# EAGLE design csa_pwr_v1.2b (EAGLE 4.15)
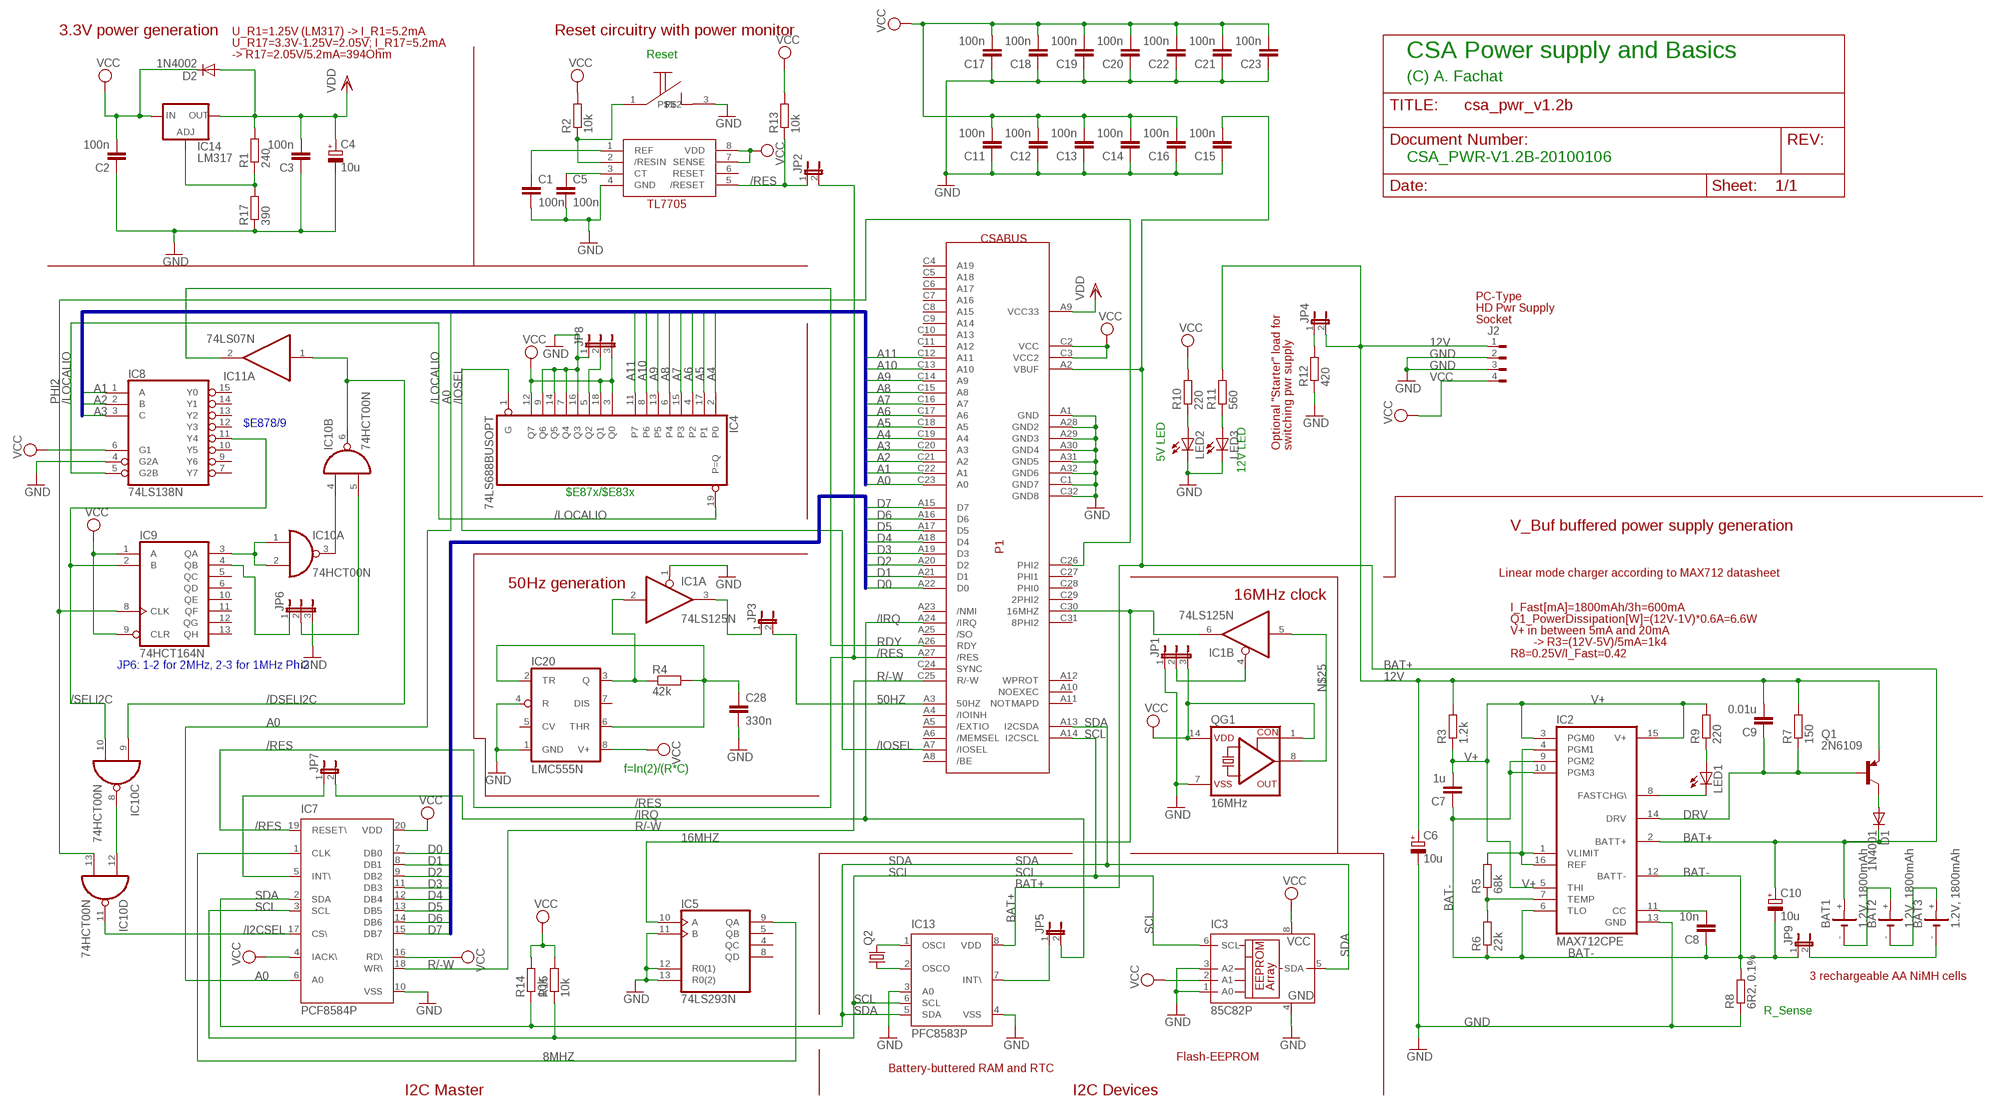
[diagram p0: schematic, sheet 1]

## Parts
BAT1  1.2V, 1800mAh  BATTERYAA  [BATTERY-AA]
BAT2  1.2V, 1800mAh  BATTERYAA  [BATTERY-AA]
BAT3  1.2V, 1800mAh  BATTERYAA  [BATTERY-AA]
C1  100n  C-EU025-025X050  [C025-025X050]
C2  100n  C5/2.5  [C5B2.5]
C3  100n  C5/2.5  [C5B2.5]
C4  10u  CPOL-EUE2-5  [E2-5]
C5  100n  C-EU025-025X050  [C025-025X050]
C6  10u  CPOL-EUE2-5  [E2-5]
C7  1u  C5/2.5  [C5B2.5]
C8  10n  C5/2.5  [C5B2.5]
C9  0.01u  C5/2.5  [C5B2.5]
C10  10u  CPOL-EUE2-5  [E2-5]
C11  100n  C5/2.5  [C5B2.5]
C12  100n  C5/2.5  [C5B2.5]
C13  100n  C5/2.5  [C5B2.5]
C14  100n  C5/2.5  [C5B2.5]
C15  100n  C5/2.5  [C5B2.5]
C16  100n  C5/2.5  [C5B2.5]
C17  100n  C5/2.5  [C5B2.5]
C18  100n  C5/2.5  [C5B2.5]
C19  100n  C5/2.5  [C5B2.5]
C20  100n  C5/2.5  [C5B2.5]
C21  100n  C5/2.5  [C5B2.5]
C22  100n  C5/2.5  [C5B2.5]
C23  100n  C5/2.5  [C5B2.5]
C28  330n  C-EU050-025X075  [C050-025X075]
D1  1N4001  DIODE-C1702-15  [C1702-15]
D2  1N4002  DIODE-C1702-15  [C1702-15]
IC1  74LS125N  [DIL14]
IC2  MAX712CPE  [DIL16]
IC3  85C82P  [DIL8]
IC4  74LS688BUSOPT  [DIL20]
IC5  74LS293N  [DIL14]
IC7  PCF8584P  [DIL20]
IC8  74LS138N  [DIL16]
IC9  74HCT164N  [DIL14]
IC10  74HCT00N  [DIL14]
IC11  74LS07N  [DIL14]
IC13  PFC8583P  [DIL08]
IC14  LM317  LM317TL  [317TL]
IC20  LMC555N  LM555N  [DIL08]
J2  FLOP-4W827001  [827001]
JP1  JP2E  [JP2]
JP2  JP1E  [JP1]
JP3  JP1E  [JP1]
JP4  JP1E  [JP1]
JP5  JP1E  [JP1]
JP6  JP2E  [JP2]
JP7  JP1E  [JP1]
JP8  JP2E  [JP2]
JP9  JP1E  [JP1]
LED1  LED3MM  [LED3MM]
LED2  LED3MM  [LED3MM]
LED3  LED3MM  [LED3MM]
P1  CSABUS  [CSABUS]
Q1  2N6109  2N6107  [TO220]
Q2  CRYTALHC49S  [HC49/S]
QG1  16MHz  CRYSTAL_RES-SG51  [SG51]
R1  240  R-EU_0204/5  [0204/5]
R2  10k  R-EU_0207/10  [0207/10]
R3  1.2k  R-EU_0204/5  [0204/5]
R4  42k  R-EU_0204/7  [0204/7]
R5  68k  R-EU_0204/5  [0204/5]
R6  22k  R-EU_0204/5  [0204/5]
R7  150  R-EU_0204/5  [0204/5]
R8  6R2, 0.1%  R-EU_0204/5  [0204/5]
R9  220  R-EU_0204/5  [0204/5]
R10  220  R-EU_0204/5  [0204/5]
R11  560  R-EU_0204/5  [0204/5]
R12  420  R-EU_RDH/15  [RDH/15]
R13  10k  R-EU_0207/10  [0207/10]
R14  10k  R-EU_0204/7  [0204/7]
R15  10k  R-EU_0204/7  [0204/7]
R17  390  R-EU_0204/5  [0204/5]
U$1  TL7705  [DIL08]
U$2  TASTER  [TASTER]

## Nets
8MHZ: IC5.9(QA) IC7.1(CLK)
12V: C6.+ C9.2 J2.1 JP4.2 Q1.3(E) R3.2 R7.2 R11.2
16MHZ: IC1.6(B:O) IC5.10(A) P1.C30(16MHZ)
50HZ: JP3.2 P1.A3(50HZ)
/DSELI2C: IC10.6(B:O) IC10.9(C:I0) IC11.1(A:I)
/I2CSEL: IC7.17(CS\) IC10.11(D:O)
/IOSEL: IC4.1(G) P1.A7(/IOSEL)
/IRQ: JP5.2 JP7.2 P1.A24(/IRQ)
/LOCALIO: IC4.19(P=Q) IC8.5(G2B)
/RES: IC7.19(RESET\) JP2.1 JP2.2 P1.A27(/RES) R13.1 U$1.5(/RESET)
/SELI2C: IC8.11(Y4) IC9.2(B) IC10.10(C:I1)
A0: IC7.6(A0) P1.C23(A0)
A1: IC8.1(A) P1.C22(A1)
A2: IC8.2(B) P1.C21(A2)
A3: IC8.3(C) P1.C20(A3)
A4: IC4.2(P0) P1.C19(A4)
A5: IC4.17(P1) P1.C18(A5)
A6: IC4.4(P2) P1.C17(A6)
A7: IC4.15(P3) P1.C16(A7)
A8: IC4.6(P4) P1.C15(A8)
A9: IC4.13(P5) P1.C14(A9)
A10: IC4.8(P6) P1.C13(A10)
A11: IC4.11(P7) P1.C12(A11)
BAT+: BAT1.+ C10.+ C15.2 D1.C IC2.2(BATT+) IC13.8(VDD) P1.A2(VBUF)
BAT-: C7.1 C8.1 C10.- IC2.6(TLO) IC2.9(PGM2) IC2.10(PGM3) IC2.12(BATT-) JP9.1 R6.1 R8.2
D0: IC7.7(DB0) P1.A22(D0)
D1: IC7.8(DB1) P1.A21(D1)
D2: IC7.9(DB2) P1.A20(D2)
D3: IC7.11(DB3) P1.A19(D3)
D4: IC7.12(DB4) P1.A18(D4)
D5: IC7.13(DB5) P1.A17(D5)
D6: IC7.14(DB6) P1.A16(D6)
D7: IC7.15(DB7) P1.A15(D7)
DRV: C9.1 IC2.14(DRV) Q1.1(B) R7.1
GND: C1.2 C2.1 C3.1 C4.- C5.2 C6.- C11.1 C12.1 C13.1 C14.1 C15.1 C16.1 C17.1 C18.1 C19.1 C20.1 C21.1 C22.1 C23.1 C28.2 IC1.1(A:OE) IC2.13(GND) IC3.1(A0) IC3.3(A2) IC3.4(GND) IC4.7(Q4) IC4.9(Q6) IC4.14(Q5) IC4.16(Q3) IC5.11(B) IC5.12(R0(1)) IC5.13(R0(2)) IC7.10(VSS) IC8.4(G2A) IC13.3(A0) IC13.4(VSS) IC20.1(GND) IC20.4(R) J2.2 J2.3 JP1.1 JP6.3 JP8.1 LED2.K(C) LED3.K(C) P1.A1(GND) P1.A28(GND2) P1.A29(GND3) P1.A30(GND4) P1.A31(GND5) P1.A32(GND6) P1.C1(GND7) P1.C32(GND8) QG1.7(VSS) R8.1 R12.1 R17.1 U$1.4(GND) U$2.3
N$1: C5.1 U$1.3(CT)
N$2: IC14.1(ADJ) R1.1 R17.2
N$3: C1.1 U$1.1(REF)
N$4: IC10.8(C:O) IC10.12(D:I0)
N$5: IC4.5(Q2) JP8.2
N$6: IC1.2(A:I) IC20.3(Q) R4.1
N$7: R2.1 U$1.2(/RESIN) U$2.1
N$9: IC1.4(B:OE) JP1.2
N$10: BAT3.- JP9.2
N$11: IC2.1(VLIMIT) IC2.4(PGM1) IC2.16(REF) R5.2
N$12: IC2.7(TEMP) R5.1 R6.2
N$13: LED1.A R9.1
N$14: IC2.8(FASTCHG\) LED1.K(C)
N$15: BAT2.- BAT3.+
N$16: C8.2 IC2.11(CC)
N$17: BAT1.- BAT2.+
N$18: LED2.A R10.1
N$19: LED3.A R11.1
N$20: D1.A Q1.2(C)
N$21: JP4.1 R12.2
N$22: IC13.7(INT\) JP5.1
N$23: IC13.2(OSCO) Q2.1
N$24: IC13.1(OSCI) Q2.2
N$25: IC1.5(B:I) QG1.8(OUT)
N$27: IC9.3(QA) IC10.1(A:I0) IC10.2(A:I1)
N$28: IC9.4(QB) JP6.1
N$29: IC10.5(B:I1) JP6.2
N$30: IC10.3(A:O) IC10.4(B:I0)
N$55: IC1.3(A:O) JP3.1
N$56: C28.1 IC20.2(TR) IC20.6(THR) R4.2
N$72: IC7.5(INT\) JP7.1
PHI2: IC9.8(CLK) IC10.13(D:I1) P1.C26(PHI2)
R/-W: IC7.18(WR\) P1.C25(R/-W)
RDY: IC11.2(A:O) P1.A26(RDY)
SCL: IC3.6(SCL) IC7.3(SCL) IC13.6(SCL) P1.A14(I2CSCL) R15.1
SDA: IC3.5(SDA) IC7.2(SDA) IC13.5(SDA) P1.A13(I2CSDA) R14.1
V+: C7.2 IC2.3(PGM0) IC2.5(THI) IC2.15(V+) R3.1 R9.2
VCC: C2.2 C11.2 C12.2 C13.2 C14.2 C16.2 C17.2 C18.2 C19.2 C20.2 C21.2 C22.2 C23.2 D2.C IC3.2(A1) IC3.8(VCC) IC4.3(Q0) IC4.12(Q7) IC4.18(Q1) IC7.4(IACK\) IC7.16(RD\) IC7.20(VDD) IC8.6(G1) IC9.1(A) IC9.9(CLR) IC14.3(IN) IC20.8(V+) J2.4 JP1.3 JP8.3 P1.C2(VCC) P1.C3(VCC2) QG1.1(CON) QG1.14(VDD) R2.2 R10.2 R13.2 R14.2 R15.2 U$1.7(SENSE) U$1.8(VDD)
VDD: C3.2 C4.+ D2.A IC14.2(OUT) P1.A9(VCC33) R1.2
Unconnected: IC1.8(C:O) IC1.9(C:I) IC1.10(C:OE) IC1.11(D:O) IC1.12(D:I) IC1.13(D:OE) IC3.7(NC) IC5.4(QC) IC5.5(QB) IC5.8(QD) IC8.7(Y7) IC8.9(Y6) IC8.10(Y5) IC8.12(Y3) IC8.13(Y2) IC8.14(Y1) IC8.15(Y0) IC9.5(QC) IC9.6(QD) IC9.10(QE) IC9.11(QF) IC9.12(QG) IC9.13(QH) IC11.3(B:I) IC11.4(B:O) IC11.5(C:I) IC11.6(C:O) IC11.8(D:O) IC11.9(D:I) IC11.10(E:O) IC11.11(E:I) IC11.12(F:O) IC11.13(F:I) IC20.5(CV) IC20.7(DIS) P1.A4(/IOINH) P1.A5(/EXTIO) P1.A6(/MEMSEL) P1.A8(/BE) P1.A10(NOEXEC) P1.A11(NOTMAPD) P1.A12(WPROT) P1.A23(/NMI) P1.A25(/SO) P1.C4(A19) P1.C5(A18) P1.C6(A17) P1.C7(A16) P1.C8(A15) P1.C9(A14) P1.C10(A13) P1.C11(A12) P1.C24(SYNC) P1.C27(PHI1) P1.C28(PHI0) P1.C29(2PHI2) P1.C31(8PHI2) U$1.6(RESET)

## Buses
D[0..7]
A[0..11]

## Notes on the sheet
- 3.3V power generation | U_R1=1.25V (LM317) -> I_R1=5.2mA | Reset circuitry with power monitor
- U_R17=3.3V-1.25V=2.05V; I_R17=5.2mA
- -> R17=2.05V/5.2mA=394Ohm | Reset | CSA Power supply and Basics
- (C) A. Fachat
- CSA_PWR-V1.2B-20100106
- PC-Type
- HD Pwr Supply
- Socket
- $E878/9
- Optional "Starter" load for | switching pwr supply
- 5V LED
- 12V LED
- $E87x/$E83x
- V_Buf buffered power supply generation
- Linear mode charger according to MAX712 datasheet
- 50Hz generation
- 16MHz clock
- I_Fast[mA]=1800mAh/3h=600mA
- Q1_PowerDissipation[W]=(12V-1V)*0.6A=6.6W
- V+ in between 5mA and 20mA
- -> R3=(12V-5V)/5mA=1k4
- R8=0.25V/I_Fast=0.42
- JP6: 1-2 for 2MHz, 2-3 for 1MHz Phi2
- f=ln(2)/(R*C)
- 3 rechargeable AA NiMH cells
- R_Sense
- Flash-EEPROM
- Battery-buttered RAM and RTC
- I2C Master | I2C Devices

## Power pins joined to a net without a drawn wire
GND: IC1.7(P:GND) IC4.10(GND) IC5.7(GND) IC8.8(GND) IC9.7(GND) IC10.7(P:GND) IC11.7(P:GND)
VCC: IC1.14(P:VCC) IC4.20(VCC) IC5.14(VCC) IC8.16(VCC) IC9.14(VCC) IC10.14(P:VCC) IC11.14(P:VCC)

## Library data of the parts
BAT1-BAT3 = csa:BATTERY
C1 C5 C28 = rcl:C-EU: CAPACITOR, European symbol
C2 C3 C7-C9 C11-C23 = capacitor-wima:C: CAPACITOR naming: grid - package width
C4 C6 C10 = rcl:CPOL-EU: POLARIZED CAPACITOR, European symbol
D1 D2 = diode:DIODE-: DIODE
IC1 = 74xx-eu:74*125: Quad bus BUFFER, 3-state
IC2 = maxim:MAX71*?: NiCd/NiMH Battery Fast-Charge Controller
IC3 = microchip:85C*: Serial EEPROM 1 K/2 K/4 K, 5.0 V, CMOS 85C72/82/92
IC4 = csa:74LS688BUSOPT
IC5 = 74xx-us:74*293: Decade and 4-bit BINARY COUNTER
IC7 = micro-philips:PCF8584: I2C-Bus CONTROLLER
IC8 = 74xx-eu:74*138: 3-line to 8-line DECODER/DEMULTIPLEXER
IC9 = 74xx-eu:74*164: 8-bit parallel out SHIFT REGISTER
IC10 = 74xx-eu:74*00: Quad 2-input NAND gate
IC11 = 74xx-eu:74*07: Hex BUFFER, open collector high-voltage output
IC13 = micro-philips:PFC8583: I2C-Bus CLOCK/CALENDAR
IC14 = v-reg:LM317TL: VOLTAGE REGULATOR
IC20 = linear:*555: TIMER
J2 = con-amp:FLOP-4W: MATE N-LOCK Floppy / HDD conector Distributor: Bürklin 71F972
JP1 JP6 JP8 = jumper:JP2E: JUMPER
JP2-JP5 JP7 JP9 = jumper:JP1E: JUMPER
LED1-LED3 = led:LED: LED OSRAM: - CHIPLED LG R971, LG N971, LY N971, LG Q971, LY Q971, LO R971, LY R971 LH N974, LH R974 LS Q976, LO Q976, LY Q976 LO Q996 - Hyper CHIPLED LW Q18S LB Q993, LB Q99A, LB R99A - SideLED LS A670, LO A670, LY A670, LG A670, LP A670 LB A673, LV A673, LT A673, LW A673 LH A674 LY A675 LS A676, LA A676, LO A676, LY A676, LW A676 LS A679, LY A679, LG A679 - Hyper Micro SIDELED® LS Y876, LA Y876, LO Y876, LY Y876 LT Y87S - SmartLED LW L88C, LW L88S LB L89C, LB L89S, LG L890 LS L89K, LO L89K, LY L89K LS L896, LA L896, LO L896, LY L896 - TOPLED LS T670, LO T670, LY T670, LG T670, LP T670 LSG T670, LSP T670, LSY T670, LOP T670, LYG T670 LG T671, LOG T671, LSG T671 LB T673, LV T673, LT T673, LW T673 LH T674 LS T676, LA T676, LO T676, LY T676, LB T676, LH T676, LSB T676, LW T676 LB T67C, LV T67C, LT T67C, LS T67K, LO T67K, LY T67K, LW E67C LS E67B, LA E67B, LO E67B, LY E67B, LB E67C, LV E67C, LT E67C LW T67C LS T679, LY T679, LG T679 LS T770, LO T770, LY T770, LG T770, LP T770 LB T773, LV T773, LT T773, LW T773 LH T774 LS E675, LA E675, LY E675, LS T675 LS T776, LA T776, LO T776, LY T776, LB T776 LHGB T686 LT T68C, LB T68C - Hyper Mini TOPLED® LB M676 - Mini TOPLED Santana® LG M470 LS M47K, LO M47K, LY M47K Source: http://www.osram.convergy.de/
P1 = csa:CSABUS
Q1 = transistor-pnp:2N6107: PNP Transistor
Q2 = crystal:CRYTAL: CRYSTAL
QG1 = crystal:CRYSTAL_RES-: CRYSTAL RESONATOR
R1-R15 R17 = rcl:R-EU_: RESISTOR, European symbol
U$1 = csa:TL7705
U$2 = csa:TASTER

## Board
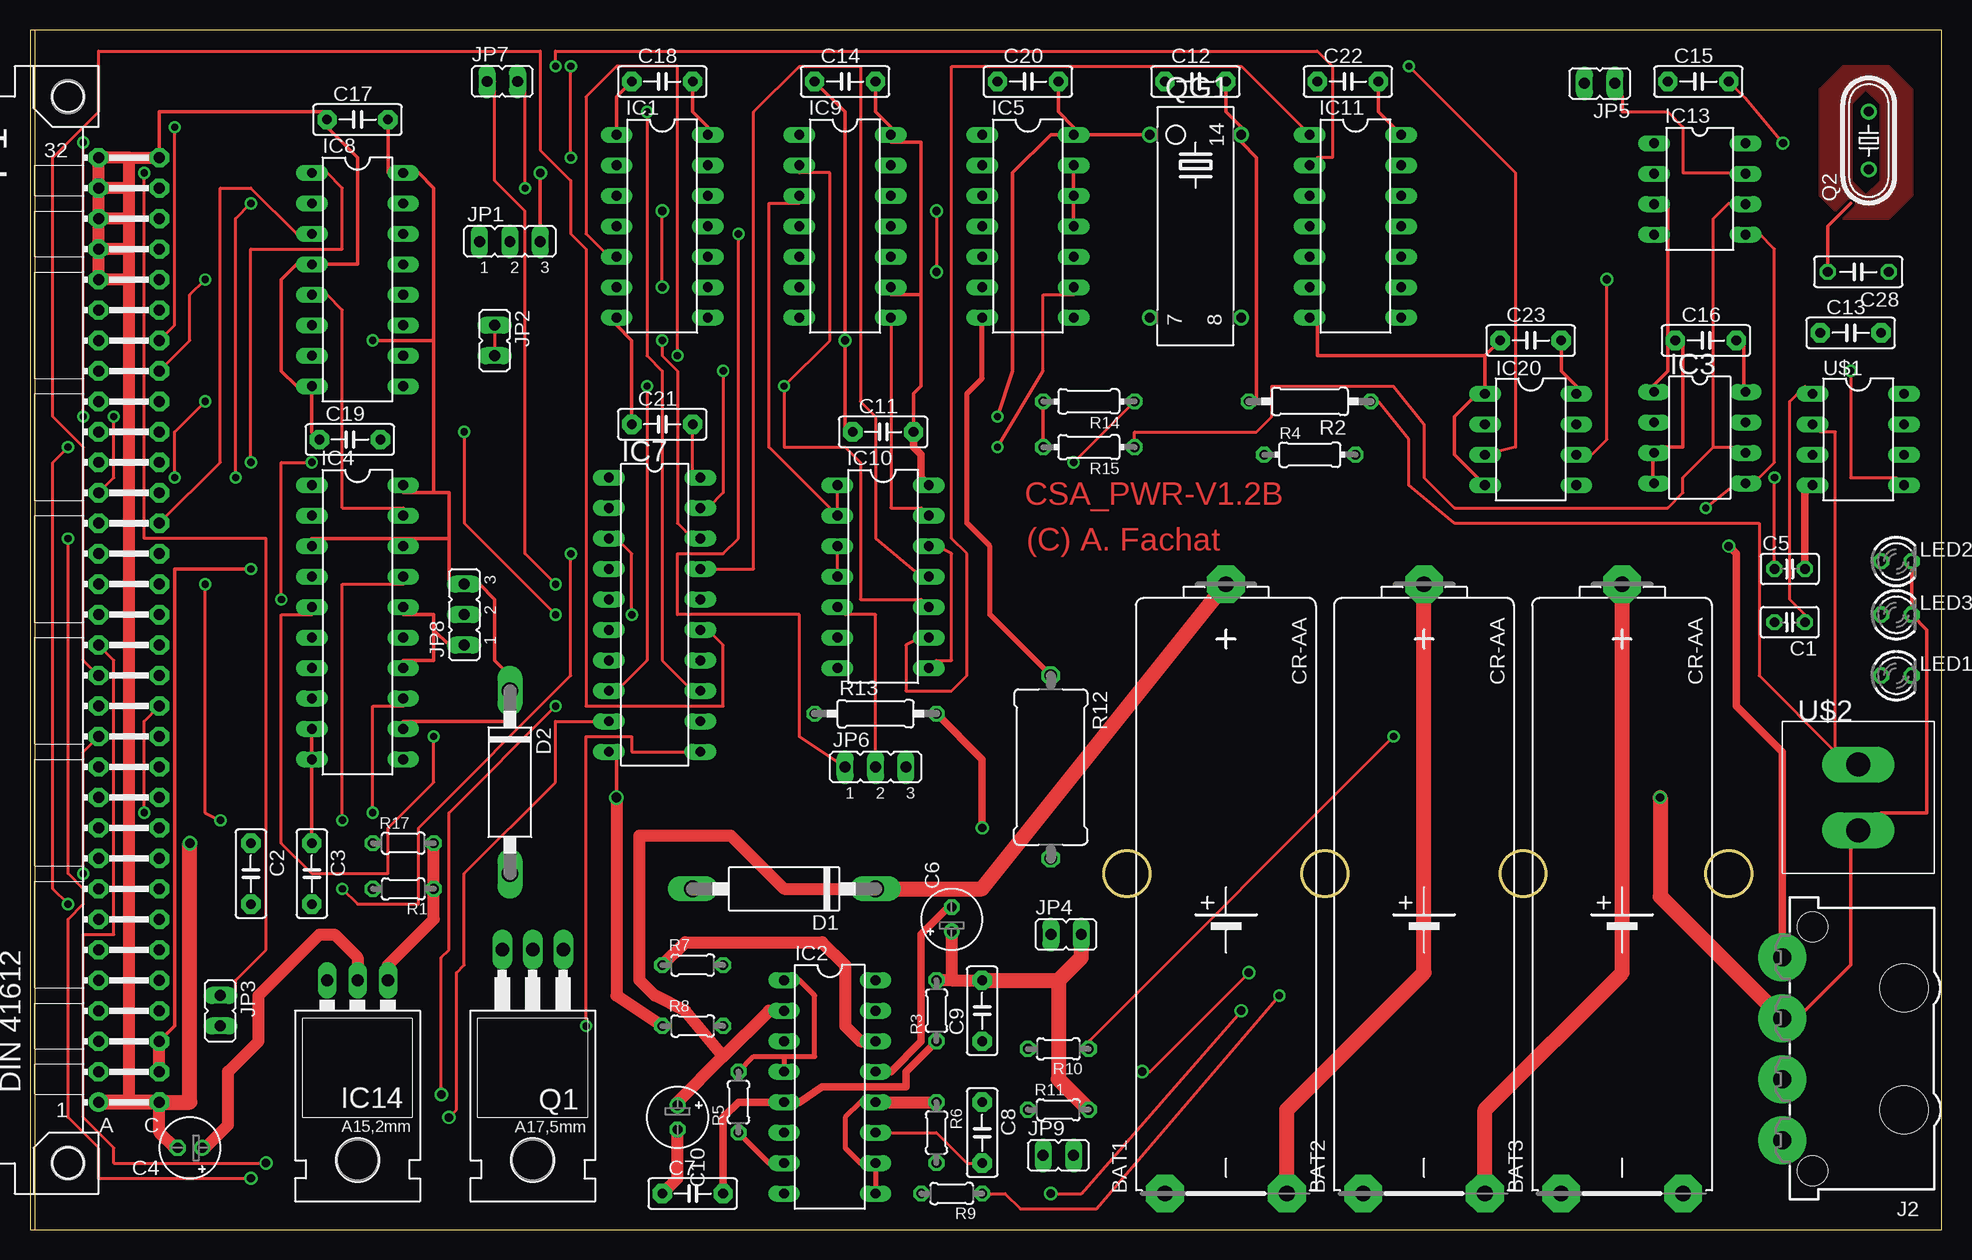
[diagram p1: board, top side]
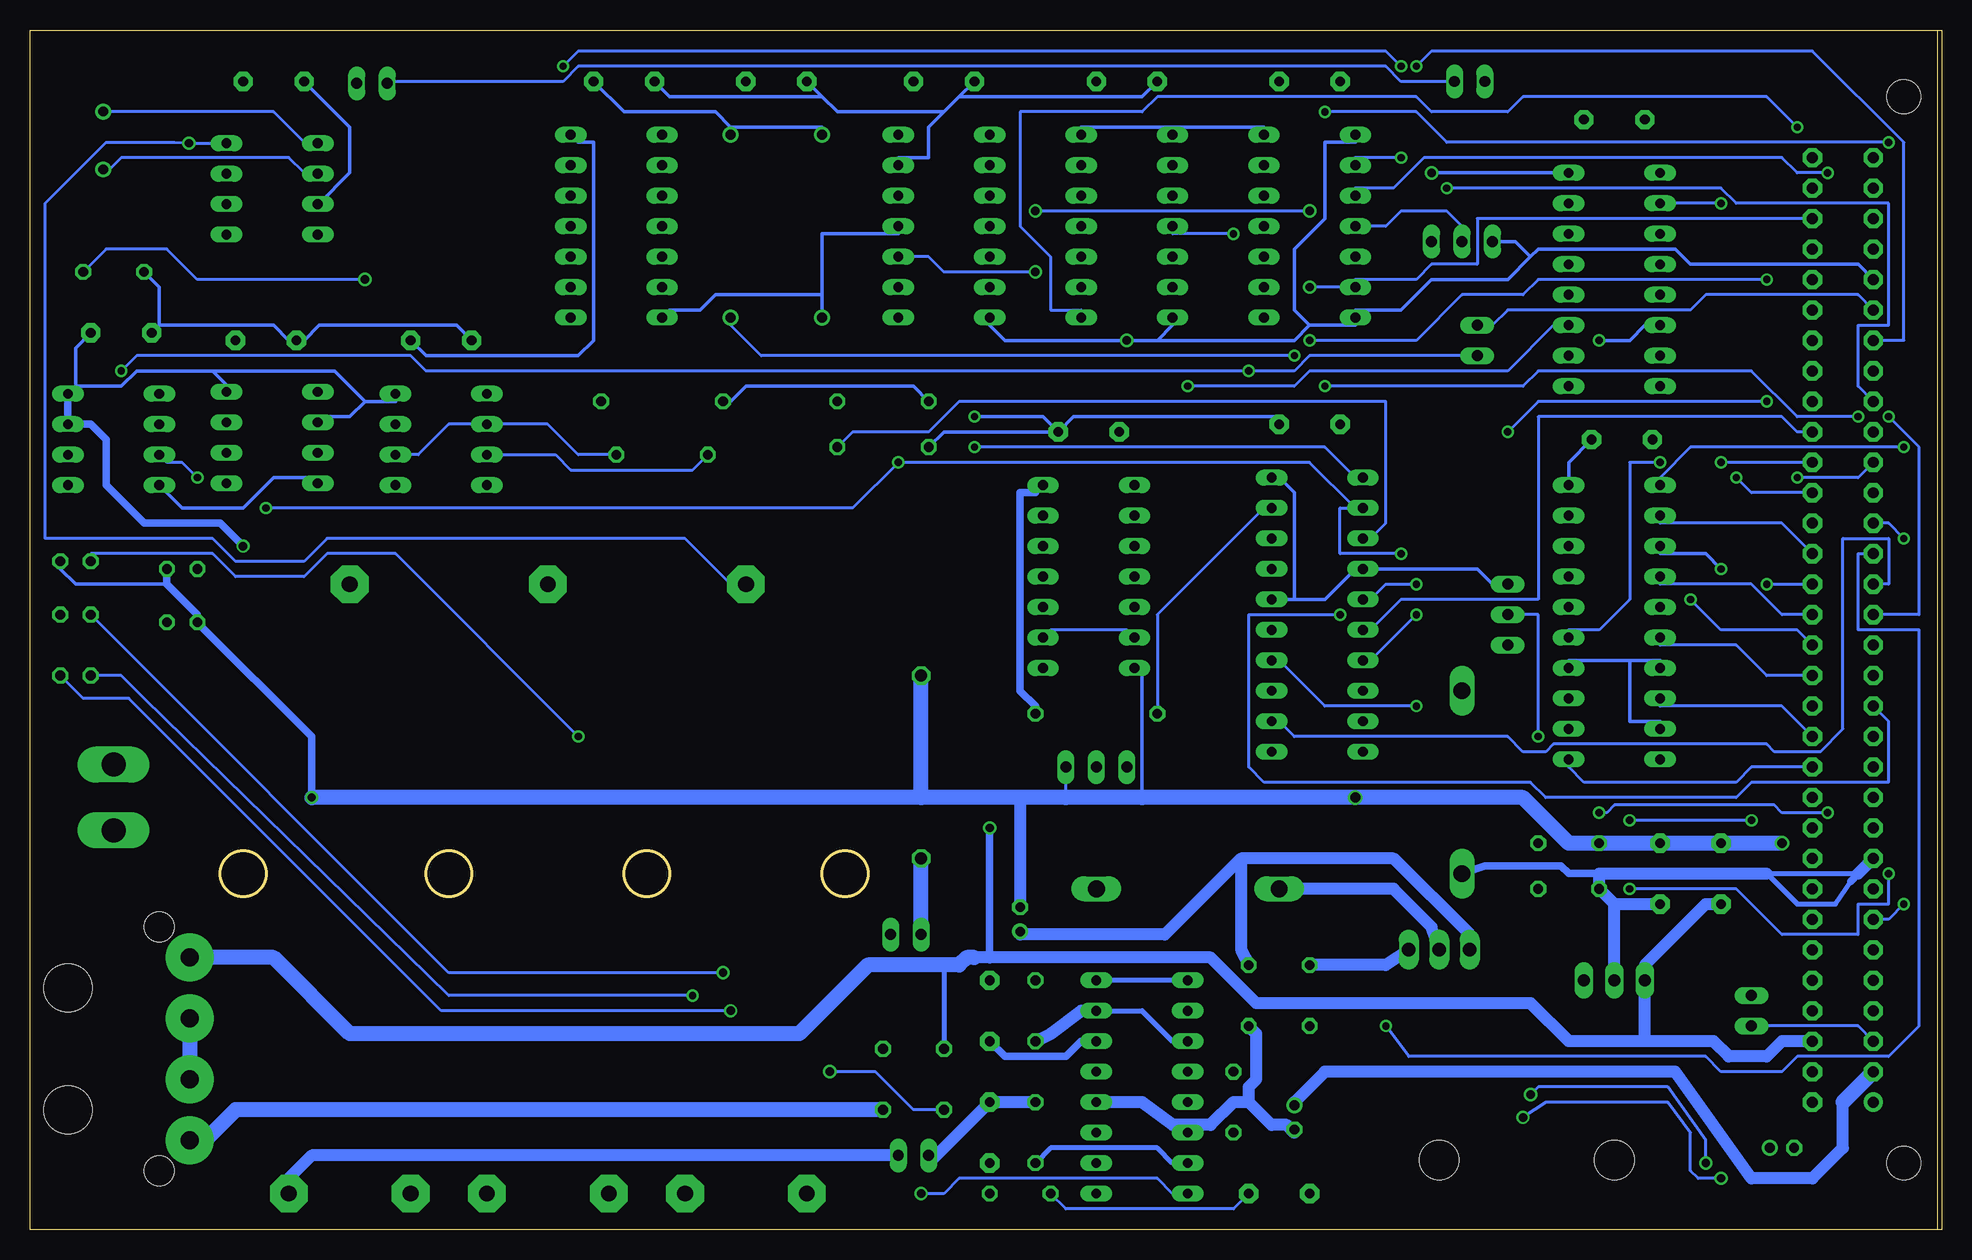
[diagram p2: board, bottom side, seen from below]

Size 159.37 x 100.03 mm. Coordinates in mm from the lower left corner, seen from the top.
Outline: 0,0.01 159.37,0.01 159.37,100.01 0,100.01 0,0.01
Outline: circle at 91.44,29.69 radius 1.91
Outline: circle at 141.6,29.69 radius 1.91
Outline: circle at 107.94,29.69 radius 1.91
Outline: circle at 124.45,29.69 radius 1.91
Copper layers (1*16): Top 0.035mm / dielectric 1.5mm / Bottom 0.035mm
Design rules "default": minimum track width 10mil, minimum drill 24mil, track to track 8mil, track to pad 8mil, pad to pad 8mil, via to via 8mil, smd to smd 8mil, copper to edge 40mil, drill to drill 8mil, minimum pad ring 10mil, minimum via ring 8mil, stop-mask expansion 4mil, vias tented up to drill 0mil, thermal gap 10mil

### Footprints (pad centres in the part's own frame; a part is rotated, then mirrored left to right if it is on the bottom)
BATTERY-AA = drill 1.321 pad 3.15 octagon: + 27.94,0; - -22.86,-5.08; -@1 -22.86,5.08
C025-025X050 = drill 0.813 octagon: 1 -1.27,0; 2 1.27,0
C5B2.5 = drill 0.813 pad 1.6 octagon: 1 -2.54,0; 2 2.54,0
E2-5 = drill 0.813 pad 1.27 round: + -1.016,0 | drill 0.813 pad 1.27 octagon: - 1.016,0
C050-025X075 = drill 0.813 octagon: 1 -2.54,0; 2 2.54,0
C1702-15 = drill 1.397 long: A 7.62,0; C -7.62,0
DIL14 = drill 0.813 long: 1 -7.62,-3.81; 2 -5.08,-3.81; 3 -2.54,-3.81; 4 0,-3.81; 5 2.54,-3.81; 6 5.08,-3.81; 7 7.62,-3.81; 8 7.62,3.81; 9 5.08,3.81; 10 2.54,3.81; 11 0,3.81; 12 -2.54,3.81; 13 -5.08,3.81; 14 -7.62,3.81
DIL16 = drill 0.813 long: 1 -8.89,-3.81; 2 -6.35,-3.81; 3 -3.81,-3.81; 4 -1.27,-3.81; 5 1.27,-3.81; 6 3.81,-3.81; 7 6.35,-3.81; 8 8.89,-3.81; 9 8.89,3.81; 10 6.35,3.81; 11 3.81,3.81; 12 1.27,3.81; 13 -1.27,3.81; 14 -3.81,3.81; 15 -6.35,3.81; 16 -8.89,3.81
DIL8 = drill 0.813 long: 1 -3.81,-3.81; 2 -1.27,-3.81; 3 1.27,-3.81; 4 3.81,-3.81; 5 3.81,3.81; 6 1.27,3.81; 7 -1.27,3.81; 8 -3.81,3.81
DIL20 = drill 0.813 long: 1 -10.16,-3.81; 2 -7.62,-3.81; 3 -5.08,-3.81; 4 -2.54,-3.81; 5 0,-3.81; 6 2.54,-3.81; 7 5.08,-3.81; 8 7.62,-3.81; 9 10.16,-3.81; 10 12.7,-3.81; 11 12.7,3.81; 12 10.16,3.81; 13 7.62,3.81; 14 5.08,3.81; 15 2.54,3.81; 16 0,3.81; 17 -2.54,3.81; 18 -5.08,3.81; 19 -7.62,3.81; 20 -10.16,3.81
DIL20' = drill 0.813 long: 1 -11.43,-3.81; 2 -8.89,-3.81; 3 -6.35,-3.81; 4 -3.81,-3.81; 5 -1.27,-3.81; 6 1.27,-3.81; 7 3.81,-3.81; 8 6.35,-3.81; 9 8.89,-3.81; 10 11.43,-3.81; 11 11.43,3.81; 12 8.89,3.81; 13 6.35,3.81; 14 3.81,3.81; 15 1.27,3.81; 16 -1.27,3.81; 17 -3.81,3.81; 18 -6.35,3.81; 19 -8.89,3.81; 20 -11.43,3.81
DIL08 = drill 0.813 long: 1 -3.81,-3.81; 2 -1.27,-3.81; 3 1.27,-3.81; 4 3.81,-3.81; 5 3.81,3.81; 6 1.27,3.81; 7 -1.27,3.81; 8 -3.81,3.81
317TL = drill 1.016 long: 1 -2.54,-3.81; 2 0,-3.81; 3 2.54,-3.81 | hole 3.302: 0,11.176
827001 = drill 1.5 pad 4 round: 1 -7.62,0; 2 -2.54,0; 3 2.54,0; 4 7.62,0 | hole 4: 5.08,-10.16; -5.08,-10.16 | hole 2.5: 10.16,-2.54; -10.16,-2.54
JP2 = drill 0.914 long: 1 -2.54,0; 2 0,0; 3 2.54,0
JP1 = drill 0.914 long: 1 0,-1.27; 2 0,1.27
LED3MM = drill 0.813 octagon: A -1.27,0; K 1.27,0
CSABUS = drill 0.914 pad 1.6 round: A1 7.62,36.83 | drill 0.914 pad 1.6 octagon: A2 7.62,34.29; A3 7.62,31.75; A4 7.62,29.21; A5 7.62,26.67; A6 7.62,24.13; A7 7.62,21.59; A8 7.62,19.05; A9 7.62,16.51; A10 7.62,13.97; A11 7.62,11.43; A12 7.62,8.89; A13 7.62,6.35; A14 7.62,3.81; A15 7.62,1.27; A16 7.62,-1.27; A17 7.62,-3.81; A18 7.62,-6.35; A19 7.62,-8.89; A20 7.62,-11.43; A21 7.62,-13.97; A22 7.62,-16.51; A23 7.62,-19.05; A24 7.62,-21.59; A25 7.62,-24.13; A26 7.62,-26.67; A27 7.62,-29.21; A28 7.62,-31.75; A29 7.62,-34.29; A30 7.62,-36.83; A31 7.62,-39.37; A32 7.62,-41.91; C1 2.54,36.83; C2 2.54,34.29; C3 2.54,31.75; C4 2.54,29.21; C5 2.54,26.67; C6 2.54,24.13; C7 2.54,21.59; C8 2.54,19.05; C9 2.54,16.51; C10 2.54,13.97; C11 2.54,11.43; C12 2.54,8.89; C13 2.54,6.35; C14 2.54,3.81; C15 2.54,1.27; C16 2.54,-1.27; C17 2.54,-3.81; C18 2.54,-6.35; C19 2.54,-8.89; C20 2.54,-11.43; C21 2.54,-13.97; C22 2.54,-16.51; C23 2.54,-19.05; C24 2.54,-21.59; C25 2.54,-24.13; C26 2.54,-26.67; C27 2.54,-29.21; C28 2.54,-31.75; C29 2.54,-34.29; C30 2.54,-36.83; C31 2.54,-39.37; C32 2.54,-41.91 | hole 2.794: 10.16,41.91; 10.16,-46.99
TO220 = drill 1.118 long: 1 -2.54,-6.35; 2 0,-6.35; 3 2.54,-6.35 | hole 3.302: 0,11.176
HC49/S = drill 0.813 round: 1 -2.413,0; 2 2.413,0
SG51 = drill 0.813 round: 1 -7.62,-3.81; 7 7.62,-3.81; 8 7.62,3.81; 14 -7.62,3.81
0204/5 = drill 0.813 octagon: 1 -2.54,0; 2 2.54,0
0207/10 = drill 0.813 octagon: 1 -5.08,0; 2 5.08,0
0204/7 = drill 0.813 octagon: 1 -3.81,0; 2 3.81,0
RDH/15 = drill 1.016 octagon: 1 -7.62,0; 2 7.62,0
DIL08' = drill 0.813 long: 1 -11.43,-2.54; 2 -8.89,-2.54; 3 -6.35,-2.54; 4 -3.81,-2.54; 5 -3.81,5.08; 6 -6.35,5.08; 7 -8.89,5.08; 8 -11.43,5.08
TASTER = drill 2.007 long: 1 0,4.013; 3 0,-1.473

### Placement (x,y rotation side)
BAT1  99.69,25.88 90 top
BAT2  116.2,25.88 90 top
BAT3  132.71,25.88 90 top
C1  146.68,50.65 180 top
C2  18.41,29.69 270 top
C3  23.49,29.69 270 top
C4  13.33,6.83 180 top
C5  146.68,55.09 0 top
C6  76.83,25.88 90 top
C7  55.24,3.02 0 top
C8  79.37,8.1 270 top
C9  79.37,18.26 90 top
C10  53.97,9.37 270 top
C11  71.11,66.52 0 top
C12  97.15,95.73 0 top
C13  151.76,74.78 0 top
C14  67.94,95.73 0 top
C15  139.06,95.73 0 top
C16  139.69,74.14 0 top
C17  27.3,92.56 0 top
C18  52.7,95.73 0 top
C19  26.66,65.89 0 top
C20  83.18,95.73 0 top
C21  52.7,67.16 0 top
C22  109.85,95.73 0 top
C23  125.09,74.14 0 top
C28  152.39,79.86 180 top
D1  62.86,28.42 180 top
D2  40,37.31 270 top
IC1  52.7,83.67 270 top
IC2  66.67,11.91 270 top
IC3  139.19,66.04 270 top
IC4  27.3,51.92 270 top
IC5  83.18,83.67 270 top
IC7  PCF8584P  [DIL20']  52.07,51.28 270 top
IC8  27.3,79.22 270 top
IC9  67.94,83.67 270 top
IC10  71.11,54.46 270 top
IC11  110.48,83.67 270 top
IC13  139.19,86.78 270 top
IC14  27.3,16.99 180 top
IC20  125.09,65.89 270 top
J2  146.04,15.09 90 top
JP1  40,82.4 0 top
JP2  38.73,74.14 180 top
JP3  15.87,18.26 180 top
JP4  86.35,24.61 270 top
JP5  130.85,95.58 90 top
JP6  70.48,38.58 0 top
JP7  39.37,95.73 270 top
JP8  36.19,51.28 90 top
JP9  85.72,6.2 270 top
LED1  155.57,46.2 0 top
LED2  155.57,55.73 0 top
LED3  155.57,51.28 0 top
P1  13.33,47.47 180 top
Q1  41.91,16.99 180 top
Q2  153.27,90.81 90 top
QG1  97.15,83.67 270 top
R1  31.11,28.42 180 top
R2  106.67,69.06 180 top
R3  75.56,18.26 90 top
R4  106.67,64.62 0 top
R5  59.05,10.64 90 top
R6  75.56,8.1 270 top
R7  55.24,22.07 0 top
R8  55.24,16.99 0 top
R9  76.83,3.02 180 top
R10  85.72,15.09 180 top
R11  85.72,10.01 0 top
R12  85.08,38.58 270 top
R13  70.48,43.03 0 top
R14  88.26,69.06 180 top
R15  88.26,65.25 180 top
R17  31.11,32.23 0 top
U$1  TL7705  [DIL08']  151.12,58.27 270 top
U$2  152.39,34.77 0 top

### Tracks (layer width: path | path; a pad name or v marks a point on that pad's centre or on a via)
8MHZ  (via drill 0.61)
  Top 0.254: v80.64,65.25 84.45,71.6 84.45,77.95 86.99,77.95 IC5.9
  Bottom 0.254: v80.64,65.25 51.43,65.25 48.89,62.71 IC7.1
12V
  Top 1.016: 76.83,20.8 C9.2 | 76.83,20.8 R3.2 | C6.+ 76.83,20.8
  Top 1.27: JP4.2 87.62,22.71 85.72,20.8 | C9.2 85.72,20.8 | 85.72,20.8 85.72,12.55 R11.2
  Bottom 0.254: 76.83,24.61 C6.+
  Bottom 1.016: 58.41,30.96 64.77,24.61 76.83,24.61 | 58.41,30.96 45.72,30.96 39.37,24.61 Q1.3 | 58.41,30.96 58.41,23.34 R7.2
  Bottom 1.27: J2.1 144.78,7.47 142.23,10.01 R11.2
16MHZ  (via drill 0.7)
  Top 0.254: v75.56,84.94 v75.56,79.86 | v52.7,78.59 v52.7,84.94
  Bottom 0.254: P1.C30 38.73,84.3 38.73,80.49 42.54,80.49 43.81,79.22 48.89,79.22 IC1.6 v52.7,78.59 | IC5.10 84.45,81.13 83.18,79.86 v75.56,79.86 | v52.7,84.94 v75.56,84.94
50HZ
  Bottom 0.254: P1.A3 6.98,16.99 JP3.2
/DSELI2C
  Top 0.254: IC11.1 100.96,97 76.83,97 76.83,57.63 78.1,56.36 78.1,46.2 76.83,44.93 73.02,44.93 73.02,48.74 74.29,49.38 IC10.9
  Bottom 0.254: IC10.6 67.94,50.01 74.29,50.01 IC10.9
/I2CSEL
  Top 0.254: IC7.17 60.32,55.09 60.32,93.19 64.13,97 69.21,97 69.21,69.06 70.48,67.79 70.48,57.63 74.29,54.46 IC10.11
/IOSEL  (via drill 0.61)
  Top 0.254: v3.17,65.25 1.9,63.98 1.9,28.42 v3.17,27.15
  Bottom 0.254: v3.17,65.25 20.95,65.25 23.49,62.71 IC4.1 | v3.17,27.15 4.44,25.88 P1.A7
/IRQ  (via drill 0.61)
  Top 0.254: v41.27,86.84 41.27,95.73 JP7.2
  Bottom 0.254: P1.A24 6.98,70.33 6.98,75.41 4.44,75.41 4.44,85.57 17.14,85.57 18.41,86.84 v41.27,86.84 | JP5.2 128.9,95.73 114.93,95.73 113.66,97 46.35,97 45.08,95.73 JP7.2
/LOCALIO
  Top 0.254: IC4.19 31.11,60.17 26.03,60.17 26.03,76.68 24.76,77.95 IC8.5
/RES  (via drill 0.61)
  Top 0.254: v151.76,71.6 151.76,62.71 155.57,62.71 U$1.5 | JP2.1 JP2.2 | v57.78,71.6 57.78,61.44 56.51,60.17 IC7.19
  Bottom 0.254: P1.A27 6.98,77.95 19.68,77.95 20.95,76.68 36.19,76.68 37.46,75.41 JP2.1 | IC7.19 56.51,60.17 65.4,51.28 R13.1 | v151.76,71.6 150.49,72.87 127.63,72.87 126.36,71.6 v57.78,71.6 53.97,71.6 52.7,72.87 JP2.2
/SELI2C  (via drill 0.61)
  Top 0.254: IC9.2 64.13,88.11 66.67,88.11 66.67,74.14 v62.86,70.33 62.86,65.25 67.94,65.25 69.21,63.98 69.21,52.55 74.29,52.55 IC10.10
  Bottom 0.254: v62.86,70.33 53.97,70.33 52.7,71.6 36.19,71.6 32.38,75.41 IC8.11
A0
  Bottom 0.254: P1.C23 12.06,66.52 13.33,67.79 33.65,67.79 33.65,52.55 45.08,52.55 47.62,50.01 IC7.6
A1  (via drill 0.61)
  Top 0.254: v18.41,63.98 18.41,81.76 26.03,81.76 26.03,86.84 24.76,88.11 IC8.1
  Bottom 0.254: P1.C22 v18.41,63.98
A2  (via drill 0.61)
  Top 0.254: v18.41,85.57 17.14,84.3 v17.14,62.71
  Bottom 0.254: v17.14,62.71 15.87,61.44 P1.C21 | v18.41,85.57 IC8.2
A3
  Top 0.254: P1.C20 15.87,63.98 15.87,86.84 18.41,86.84 22.22,83.03 IC8.3
A4
  Bottom 0.254: P1.C19 13.33,58.9 23.49,58.9 IC4.2
A5  (via drill 0.61)
  Top 0.254: v26.03,34.14 26.03,53.82 31.11,53.82 IC4.17 | v15.87,34.14 14.6,34.77 v14.6,53.82
  Bottom 0.254: v15.87,34.14 v26.03,34.14 | v14.6,53.82 P1.C18
A6
  Bottom 0.254: P1.C17 13.33,51.28 15.87,53.82 23.49,53.82 IC4.4
A7  (via drill 0.61)
  Top 0.254: v23.49,63.98 20.95,63.98 v20.95,52.55
  Bottom 0.254: v23.49,63.98 26.03,63.98 26.03,52.55 28.57,50.01 31.11,50.01 IC4.15 | v20.95,52.55 18.41,50.01 12.06,50.01 P1.C16
A8
  Bottom 0.254: P1.C15 14.6,46.2 17.14,48.74 23.49,48.74 IC4.6
A9  (via drill 0.61)
  Top 0.254: v28.57,34.77 28.57,43.66 31.11,43.66 IC4.13 | v9.52,34.77 9.52,42.39 P1.C14
  Bottom 0.254: v9.52,34.77 13.33,34.77 13.97,35.41 27.3,35.41 27.93,34.77 v28.57,34.77
A10
  Bottom 0.254: P1.C13 13.33,43.66 23.49,43.66 IC4.8
A11
  Bottom 0.254: P1.C12 15.87,38.58 17.14,37.31 29.84,37.31 31.11,38.58 IC4.11
BAT+  (via drill 0.7)
  Top 0.254: v146.11,90.59 142.94,94.4 C15.2
  Top 1.016: 57.78,14.45 61.59,18.26 IC2.2 | 57.78,14.45 54.61,18.26 52.07,19.53 50.8,20.8 50.8,32.87 58.41,32.87 62.86,28.42 D1.C 71.75,28.42 | C10.+ 53.97,10.64 57.78,14.45
  Top 1.27: 71.75,28.42 79.37,28.42 BAT1.+
  Bottom 0.254: BAT1.+ 100.96,53.82 104.77,57.63 134.62,57.63 136.52,55.73 142.23,55.73 144.14,57.63 158.11,57.63 158.11,85.57 153.03,90.65 147.31,90.65 v146.11,90.59 146.04,90.65 145.98,90.59 IC13.8
  Bottom 1.016: 8.25,10.64 8.25,6.83 10.79,4.29 15.87,4.29 22.22,13.18 51.43,13.18 53.97,10.64 C10.+
  Bottom 1.27: 8.25,10.64 P1.A2
BAT-
  Top 0.406: IC2.9 IC2.10 69.21,5.56 67.94,6.83 67.94,9.37 69.21,10.64 IC2.12
  Top 1.016: IC2.12 R6.1 | C7.1 53.97,4.29 C10.-
  Bottom 0.254: 62.86,8.74 IC2.6
  Bottom 1.016: IC2.12 66.67,10.64 64.13,8.74 62.86,8.74 60.96,8.74 59.05,10.64 57.78,10.64 | R6.1 C8.1 84.45,5.56 JP9.1 | 57.78,10.64 55.88,8.74 54.61,8.74 53.97,8.1 C10.- | 57.78,10.64 57.78,11.91 57.15,12.55 57.15,16.36 R8.2
D0  (via drill 0.61)
  Top 0.254: v43.81,51.28 36.19,58.9 v36.19,66.52 | v14.6,69.06 12.06,66.52 v12.06,62.71
  Bottom 0.254: v43.81,51.28 47.62,47.47 IC7.7 | v36.19,66.52 33.65,69.06 v14.6,69.06 | v12.06,62.71 6.98,62.71 P1.A22
D1  (via drill 0.61)
  Top 0.254: v51.43,70.33 51.43,47.47 48.89,44.93 IC7.8 | v6.98,67.79 6.98,62.71 P1.A21
  Bottom 0.254: v51.43,70.33 34.92,70.33 33.65,71.6 15.87,71.6 12.06,67.79 v6.98,67.79
D2  (via drill 0.61, 0.7)
  Top 0.254: v18.41,4.29 5.71,4.29 5.71,6.83 3.17,9.37 3.17,25.88 4.44,27.15 4.44,28.42 3.17,29.69 v3.17,57.63 | IC7.9 43.81,42.39 43.81,37.31 36.19,29.69 36.19,22.07 35.55,21.44 35.55,10.01 v34.92,9.37
  Bottom 0.254: v3.17,57.63 4.44,58.9 P1.A20 | v18.41,4.29 20.31,4.29 20.95,4.93 20.95,8.1 22.86,10.64 33.02,10.64 v34.92,9.37
D3  (via drill 0.61)
  Top 0.254: v46.35,16.99 46.35,41.12 50.16,41.12 50.16,39.85 IC7.11
  Bottom 0.254: v46.35,16.99 44.45,14.45 19.68,14.45 18.41,13.18 13.33,13.18 12.06,14.45 4.44,14.45 1.9,16.99 1.9,50.01 6.98,50.01 6.98,56.36 P1.A19
D4
  Bottom 0.254: P1.A18 4.44,53.82 4.44,57.63 8.25,57.63 8.25,41.76 10.16,39.85 13.97,39.85 14.6,40.49 32.38,40.49 33.02,39.85 34.92,39.85 36.19,41.12 53.97,41.12 55.24,42.39 IC7.12
D5  (via drill 0.61)
  Top 0.254: v51.43,93.19 51.43,72.87 52.7,71.6 52.7,47.47 55.24,44.93 IC7.13 | v4.44,67.79 v4.44,90.65
  Bottom 0.254: v51.43,93.19 43.81,93.19 41.27,90.65 v4.44,90.65 | v4.44,67.79 1.9,65.25 1.9,51.28 P1.A17
D6  (via drill 0.61, 0.7)
  Top 0.254: v43.81,43.66 34.92,34.77 34.92,23.34 34.29,22.71 v34.29,11.28 | P1.A16 6.98,47.47 6.98,24.61 4.44,24.61 4.44,9.37 6.98,6.83 6.98,5.56 v19.68,5.56
  Bottom 0.254: v43.81,43.66 51.43,43.66 55.24,47.47 IC7.14 | v19.68,5.56 19.68,7.47 22.86,11.91 33.65,11.91 v34.29,11.28
D7
  Top 0.254: P1.A15 4.44,47.47 4.44,65.25 1.9,67.79 1.9,89.38 5.71,93.19 5.71,98.27 42.54,98.27 42.54,90.02 45.08,87.48 45.08,83.03 46.35,81.76 46.35,43.66 57.78,43.66 57.78,48.74 56.51,50.01 IC7.15
DRV
  Top 1.016: R7.1 54.61,23.98 66.03,23.98 67.94,22.07 67.94,16.99 69.21,15.72 IC2.14
  Bottom 0.61: C9.1 78.1,14.45 73.02,14.45 71.75,15.72 IC2.14
  Bottom 1.016: R7.1 46.35,22.07 Q1.1
GND  (via drill 0.7, 0.8)
  Top 0.254: C6.- 76.83,27.15 | C4.- 12.06,6.83 | IC3.4 135.25,62.71 | 135.25,65.25 IC3.3 | C16.1 136.52,74.14
  Top 0.305: v48.89,36.04 48.89,39.85 IC7.10 | 33.65,50.01 33.65,51.28 31.11,51.28 IC4.16 | 33.65,50.01 34.92,48.74 JP8.1 | 33.65,50.01 33.65,47.47 31.11,47.47 IC4.14 | IC4.9 IC4.10 C3.1 | P1.C32 10.79,93.19 24.76,93.19 C17.1 24.76,91.92 27.3,89.38 27.3,80.49 IC8.4 22.22,80.49 20.95,79.22 20.95,71.6 22.22,70.33 IC8.8 23.49,66.52 C19.1 | J2.3 147.95,18.26 151.76,22.07 151.76,32.23 U$2.3 154.3,34.77 158.11,34.77 158.11,50.01 LED3.K LED2.K | 136.52,83.03 136.52,85.57 IC13.3 | 135.25,62.71 135.25,65.25 137.79,65.25 137.79,74.14 C16.1 | IC3.1 135.25,70.33 136.52,71.6 136.52,74.14 136.52,83.03 | 136.52,83.03 IC13.4 | C18.1 48.89,94.46 IC1.1 | IC1.7 48.89,75.41 50.16,74.14 C21.1 | C14.1 67.94,93.19 v67.94,74.14 67.94,66.52 C11.1 | C23.1 121.28,72.87 | 121.28,72.87 IC20.1 120.64,69.7 118.74,67.79 118.74,64.62 IC20.4 | IC5.11 IC5.12 IC5.13 | 121.28,72.87 107.31,72.87 107.31,75.41 IC11.7 | C28.2 149.85,83.67 151.76,85.57
  Top 0.406: IC5.7 79.37,70.97 78.1,69.7 78.1,58.9 80,57 80,51.28 R12.1
  Top 0.61: 76.83,27.15 74.29,24.61 74.29,15.72 71.75,13.18 IC2.13 | C5.2 147.95,61.44 U$1.4
  Top 1.016: P1.A29 P1.A28 8.25,79.22 | P1.A30 P1.A31 | P1.A31 P1.A32 8.25,89.38 | 8.25,89.38 P1.C32 | P1.A29 P1.A30 | 12.06,6.83 10.79,8.1 P1.C1 | v48.89,36.04 48.89,19.53 R8.1 | 8.25,86.84 8.25,89.38 | 8.25,84.3 8.25,86.84 | 8.25,81.76 8.25,84.3 | 8.25,79.22 8.25,81.76 | 8.25,10.64 8.25,79.22 | 8.25,81.76 P1.A29 | 8.25,84.3 P1.A30 | 8.25,86.84 P1.A31
  Top 1.27: P1.A1 8.25,10.64 P1.C1 13.33,10.64 v13.33,32.23 | v135.88,36.04 135.88,27.79 J2.3
  Bottom 0.254: 76.83,27.15 C6.- | 73.02,36.04 JP6.3 | 31.11,47.47 IC4.14 | 156.84,55.09 LED2.K | C16.1 137.79,74.14 | 135.25,62.71 IC3.4 | 48.89,90.65 IC1.1 | IC5.11 86.99,83.03 | 86.99,89.38 IC5.13 | 48.89,76.68 IC1.7 | 148.59,75.41 C13.1 | IC13.3 135.32,85.51
  Bottom 0.305: 66.67,36.04 66.67,46.2 IC10.7 | 26.03,47.47 31.11,47.47 | 26.03,47.47 23.49,47.47 IC4.7 | 26.03,47.47 26.03,42.39 23.49,42.39 IC4.9 | C1.2 145.41,51.28 | 156.84,55.09 155.57,53.82 147.95,53.82 | 137.79,74.14 139.06,75.41 148.59,75.41 148.59,78.59 C28.2 | 135.25,62.71 139.06,62.71 141.6,60.17 146.68,60.17 U$1.4 | 48.89,90.65 51.43,90.65 51.43,84.3 53.97,81.76 53.97,76.68 52.7,75.41 | 65.4,74.14 64.13,75.41 IC9.7 | 65.4,74.14 v67.94,74.14 78.1,74.14 79.37,75.41 IC5.7 | 52.7,75.41 48.89,75.41 IC1.7 | 52.7,75.41 53.97,74.14 65.4,74.14 | 93.34,77.95 93.34,83.03 86.99,83.03 | 93.34,77.95 QG1.7 | 93.34,77.95 102.23,77.95 103.5,76.68 106.04,76.68 IC11.7 | 83.18,93.19 84.45,91.92 84.45,89.38 86.99,89.38 | 81.91,94.46 83.18,93.19 | 81.91,94.46 C20.1 | 93.34,94.46 92.07,93.19 83.18,93.19 | 93.34,94.46 C12.1 | C22.1 106.04,94.46 93.34,94.46 | C14.1 66.67,94.46 81.91,94.46 | C23.1 123.82,75.41 135.25,75.41 136.52,74.14 C16.1 | P1.A28 6.98,80.49 20.95,80.49 22.22,81.76 33.65,81.76 34.29,81.13 | 34.29,81.13 36.19,79.22 42.54,79.22 45.08,76.68 48.89,76.68 | C15.1 132.71,91.92 132.71,88.11 135.32,85.51 | JP1.1 35.55,82.4 34.29,81.13
  Bottom 0.61: 145.41,51.28 147.95,53.82 C5.2 | v135.88,36.04 135.88,41.12 C1.2
  Bottom 1.016: 76.83,36.04 76.83,27.15
  Bottom 1.27: v13.33,32.23 C2.1 C3.1 R17.1 31.11,32.23 34.92,36.04 v48.89,36.04 66.67,36.04 73.02,36.04 76.83,36.04 85.08,36.04 | 85.08,36.04 R12.1 | J2.2 146.04,16.99 145.41,17.63 J2.3 | 85.08,36.04 v135.88,36.04
N$1  (via drill 0.61)
  Top 0.254: C5.1 v145.41,62.71
  Bottom 0.254: v145.41,62.71 146.68,63.98 147.95,63.98 U$1.3
N$2
  Top 1.016: R17.2 R1.1 33.65,25.88 29.84,22.07 IC14.1
N$3
  Top 0.254: C1.1 147.95,51.28 146.68,52.55 146.68,69.06 147.95,70.33 U$1.1
N$4
  Top 0.254: IC10.8 75.56,47.47 76.83,47.47 76.83,56.36 75.56,57 IC10.12
N$5  (via drill 0.61)
  Top 0.254: v33.65,41.12 33.65,37.31 29.84,33.5 29.84,29.69 23.49,29.69 20.95,32.23 20.95,51.28 23.49,51.28 IC4.5
  Bottom 0.254: v33.65,41.12 33.65,51.28 JP8.2
N$6  (via drill 0.61)
  Top 0.254: v45.08,89.38 v45.08,97 | v114.93,97 123.82,88.11 123.82,65.25 IC20.3
  Bottom 0.254: v45.08,89.38 48.89,89.38 IC1.2 | v45.08,97 46.35,98.27 113.66,98.27 v114.93,97 | IC20.3 115.56,64.62 114.3,63.35 104.13,63.35 R4.1
N$7
  Top 0.254: 150.49,39.85 144.14,46.2 144.14,58.9 118.74,58.9 114.93,62.08 114.93,65.89 112.39,69.06 R2.1 | 150.49,39.85 150.49,66.52 149.22,66.52 U$1.2 | 150.49,39.85 U$2.1
N$8
  pour Top: 153.03,97 154.94,97 156.84,95.1 156.84,86.21 154.94,84.3 153.03,84.3 153.03,86.21 154.3,87.48 154.3,93.83 153.03,95.1
  pour Top: 153.03,84.3 151.12,84.3 149.22,86.21 149.22,95.1 151.12,97 153.03,97 153.03,95.1 151.76,93.83 151.76,87.48 153.03,86.21
N$9
  Bottom 0.254: IC1.4 46.35,83.67 45.08,84.94 41.27,84.94 40,83.67 JP1.2
N$10
  Bottom 1.016: JP9.2 135.88,6.2 137.79,4.29 BAT3.-
N$11
  Top 0.254: 64.13,20.8 IC2.1
  Top 0.406: R5.2 60.32,14.45 62.86,14.45 | 62.86,14.45 65.4,14.45 65.4,19.53 64.13,20.8 | 62.86,14.45 IC2.4
  Bottom 0.406: IC2.1 IC2.16
N$12
  Top 0.406: R5.1 61.59,5.56 IC2.7
  Bottom 0.254: IC2.7 64.13,5.56
  Bottom 0.406: R6.2 74.29,6.83 65.4,6.83 64.13,5.56
N$13  (via drill 0.61)
  Top 0.254: R9.1 81.27,3.02 82.55,1.75 88.89,1.75 v104.13,19.53
  Bottom 0.254: LED1.A 151.76,46.2 149.85,44.3 124.45,19.53 v104.13,19.53
N$14  (via drill 0.7)
  Top 0.254: v85.08,3.02 87.62,3.02 v100.96,18.26
  Bottom 0.254: IC2.8 64.13,3.02 65.4,4.29 81.91,4.29 83.18,3.02 v85.08,3.02 | v100.96,18.26 125.09,18.26 151.12,44.3 154.94,44.3 LED1.K
N$15
  Top 1.27: BAT2.- 121.28,10.01 132.71,21.44 BAT3.+
N$16
  Top 0.254: C8.2 78.1,5.56 75.56,8.1 IC2.11
N$17
  Top 1.27: BAT1.- 104.77,10.01 116.2,21.44 BAT2.+
N$18  (via drill 0.61)
  Top 0.254: v113.66,41.12 88.26,15.72 R10.1
  Bottom 0.254: v113.66,41.12 128.9,56.36 134.62,56.36 136.52,54.46 142.23,54.46 144.14,56.36 154.3,56.36 LED2.A
N$19  (via drill 0.7)
  Top 0.254: v92.7,13.18 93.34,13.18 v101.59,21.44
  Bottom 0.254: R11.1 85.72,10.01 88.89,13.18 v92.7,13.18 | v101.59,21.44 124.45,21.44 LED3.A
N$20
  Bottom 1.016: Q1.2 42.54,25.25 45.72,28.42 D1.A
N$21
  Bottom 1.27: JP4.1 R12.2
N$22
  Top 0.254: IC13.7 142.87,88.11 137.79,88.11 137.79,91.92 136.52,93.19 132.71,93.19 132.71,94.46 JP5.1
N$23
  Bottom 0.254: IC13.2 136.52,88.11 137.79,89.38 151.76,89.38 153.03,88.11 Q2.1
N$24
  Bottom 0.254: IC13.1 136.52,90.65 139.06,93.19 153.03,93.19 Q2.2
N$25  (via drill 0.61)
  Top 0.254: v53.97,72.87 53.97,97 48.89,97 46.35,94.46 46.35,83.03 48.26,81.13 IC1.5
  Bottom 0.254: v53.97,72.87 98.42,72.87 100.96,75.41 QG1.8
N$27
  Top 0.254: IC10.1 IC10.2 61.59,65.25 61.59,85.57 64.13,85.57 IC9.3
N$28  (via drill 0.61)
  Top 0.254: v59.05,83.03 59.05,57.63 57.78,56.36 53.97,56.36 53.97,51.28 64.13,51.28 64.13,41.12 JP6.1
  Bottom 0.254: v59.05,83.03 64.13,83.03 IC9.4
N$29
  Top 0.254: IC10.5 67.94,51.28 70.48,51.28 JP6.2
N$30
  Top 0.254: IC10.4 IC10.3
N$55  (via drill 0.61)
  Top 0.254: JP3.1 17.14,19.53 17.14,20.8 19.68,23.34 19.68,57.63 9.52,57.63 v9.52,88.11
  Bottom 0.254: v9.52,88.11 12.06,88.11 13.33,89.38 43.18,89.38 45.72,86.84 48.89,86.84 IC1.3
N$56  (via drill 0.7)
  Top 0.254: IC20.6 130.17,64.62 131.44,65.89 v131.44,79.22
  Bottom 0.254: IC20.6 126.99,64.62 124.45,67.16 IC20.2 116.2,67.16 113.66,64.62 R4.2 | v131.44,79.22 145.41,79.22 147.95,81.76 153.03,81.76 C28.1
N$72  (via drill 0.61)
  Top 0.254: v43.81,53.82 41.27,56.36 41.27,84.94 38.73,87.48 38.73,95.73 JP7.1
  Bottom 0.254: v43.81,53.82 46.35,53.82 47.62,52.55 IC7.5
PHI2  (via drill 0.61)
  Top 0.254: IC10.13 74.29,60.17 71.75,60.17 IC9.8 | P1.C26 12.06,75.41 v12.06,91.92
  Bottom 0.254: v12.06,91.92 14.6,94.46 34.92,94.46 36.19,93.19 42.54,93.19 43.81,94.46 65.4,94.46 66.67,93.19 76.83,93.19 76.83,83.67 74.29,81.13 74.29,76.68 71.75,76.68 IC9.8
R/-W  (via drill 0.61)
  Top 0.254: v52.7,74.14 52.7,72.87 53.97,71.6 53.97,58.9 55.24,57.63 IC7.18 | v14.6,79.22 13.33,77.95 13.33,74.14 P1.C25
  Bottom 0.254: v52.7,74.14 43.81,74.14 40,77.95 34.92,77.95 33.65,79.22 v14.6,79.22
RDY  (via drill 0.61)
  Top 0.254: v43.81,97 43.81,98.27 107.31,98.27 108.58,97 108.58,89.38 107.31,89.38 IC11.2
  Bottom 0.254: v43.81,97 42.54,98.27 10.79,98.27 3.17,90.65 3.17,74.14 P1.A26
SCL  (via drill 0.61)
  Top 0.254: 140.33,65.25 142.87,65.25 IC3.6 | 140.33,65.25 140.33,84.3 141.6,85.57 142.87,85.57 IC13.6 | v50.16,51.28 50.16,56.36 48.89,57.63 IC7.3 | 140.33,65.25 137.79,62.71 137.79,61.44 136.52,60.17 118.74,60.17 116.2,62.71 116.2,67.16 113.66,70.33 103.5,70.33 103.5,67.79 102.23,66.52 92.07,66.52 R15.1
  Bottom 0.254: R15.1 90.8,66.52 84.45,66.52 81.91,69.06 46.35,69.06 46.35,58.9 47.62,57.63 IC7.3 | P1.A14 4.44,42.39 4.44,37.31 15.87,37.31 17.14,36.04 33.02,36.04 34.29,37.31 56.51,37.31 57.78,38.58 57.78,51.28 v50.16,51.28
SDA  (via drill 0.61)
  Top 0.254: 142.87,62.71 144.14,62.71 145.41,63.98 145.41,81.76 144.14,83.03 IC13.5 | v86.99,63.98 R14.1 | P1.A13 4.44,39.85 v4.44,29.69 | v26.03,28.42 27.3,27.15 32.38,27.15 32.38,33.5 45.08,46.2 v45.08,56.36 | v139.69,60.17 142.87,62.71 | 142.87,62.71 IC3.5
  Bottom 0.254: 48.89,60.17 52.7,63.98 v86.99,63.98 90.8,60.17 v139.69,60.17 | v4.44,29.69 4.44,27.15 6.98,27.15 6.98,24.61 13.33,24.61 17.14,28.42 v26.03,28.42 | v45.08,56.36 50.16,56.36 50.16,60.17 48.89,60.17 | 48.89,60.17 IC7.2
V+
  Top 0.254: IC2.5 64.13,10.64
  Top 0.61: C7.2 57.78,9.37 59.05,10.64 IC2.5 | R3.1 73.02,13.18 73.02,11.91 66.03,11.91 64.13,10.64
  Bottom 0.254: R9.2 73.02,1.75 59.05,1.75 C7.2
  Bottom 0.406: IC2.3 64.13,15.72 66.67,18.26 IC2.15
  Bottom 1.016: R3.1 74.29,16.36 71.75,18.26 IC2.15
VCC  (via drill 0.61, 0.7)
  Top 0.254: IC3.8 142.87,70.33 | QG1.14 100.96,91.92 | IC1.14 56.51,91.92 | 71.75,90.65 IC9.14 | R2.2 102.23,69.06 | 55.24,62.71 C21.2
  Top 0.305: P1.C3 12.06,16.99 12.06,55.09 v18.41,55.09 | C23.2 127.63,71.6 128.9,70.33 IC20.8 | 142.87,70.33 142.87,74.14 C16.2 | C22.2 112.39,93.19 IC11.14 | 100.96,91.92 99.69,93.19 C12.2 | C20.2 85.72,93.19 86.99,91.92 IC5.14 | C14.2 70.48,93.19 71.75,91.92 IC9.14 | 56.51,91.92 55.24,93.19 C18.2 | R15.2 R14.2 | 74.29,77.95 71.75,77.95 IC9.9 | C11.2 73.66,69.7 74.29,70.33 74.29,77.95 | 71.75,90.65 74.29,90.65 74.29,77.95 | 102.23,69.06 102.23,89.38 100.96,90.65 QG1.14 | IC7.20 55.24,62.71 | IC4.12 31.11,42.39 40,42.39 D2.C 40,46.2 38.73,47.47 38.73,52.55 37.46,53.82 JP8.3 34.92,53.82 34.92,57.63 | C17.2 29.84,88.11 IC8.16 32.38,88.11 33.65,86.84 33.65,74.14 | 33.65,61.44 34.92,61.44 34.92,57.63 | 33.65,61.44 31.11,61.44 IC4.20 | 33.65,74.14 v28.57,74.14 | 33.65,61.44 33.65,74.14 | 31.11,57.63 23.49,57.63 IC4.3 | 31.11,57.63 34.92,57.63 | 31.11,57.63 IC4.18 | v80.64,67.79 81.91,71.6 81.91,88.11 85.08,91.29 IC5.14 | IC5.14 QG1.1 | v42.54,88.11 JP1.3
  Top 0.61: C11.2 73.66,65.25 74.29,64.62 74.29,62.71 IC10.14 | J2.4 146.04,39.85 142.23,43.66 142.23,56.36 v141.6,57 | v79.37,33.5 79.37,39.22 R13.2
  Top 1.016: P1.C2 P1.C3
  Bottom 0.254: 135.25,67.79 IC3.2 | U$1.8 155.57,70.33 | 142.87,70.33 IC3.8 | QG1.1 93.34,91.92 | 64.13,91.92 IC9.1 | 100.96,69.06 R2.2 | R13.2 75.56,43.66 | 23.49,56.36 IC4.3
  Bottom 0.305: 135.25,67.79 132.71,67.79 131.44,69.06 | 131.44,69.06 128.9,69.06 IC20.8 | 144.14,71.6 150.49,71.6 151.76,70.33 155.57,70.33 155.57,73.51 C13.2 | 144.14,71.6 142.87,70.33 | 131.44,69.06 133.98,71.6 144.14,71.6 | 93.34,91.92 100.96,91.92 | C22.2 109.85,93.19 102.23,93.19 100.96,91.92 | 100.96,91.92 QG1.14 | IC1.14 56.51,91.92 64.13,91.92 71.75,91.92 IC9.14 | 100.96,69.06 99.69,70.33 85.72,70.33 R14.2 | 75.56,61.44 IC10.14 | R15.2 83.18,66.52 C11.2 | C23.2 126.36,72.87 113.66,72.87 112.39,74.14 112.39,90.65 113.66,90.65 IC11.14 | 53.97,52.55 51.43,52.55 48.89,55.09 IC7.4 38.73,55.09 37.46,53.82 JP8.3 | 53.97,52.55 IC7.16 | 53.97,52.55 53.97,61.44 55.24,62.71 IC7.20 | v28.57,74.14 26.03,74.14 24.76,75.41 IC8.6 | v18.41,55.09 19.68,56.36 23.49,56.36 | C21.2 55.24,67.79 72.38,67.79 C11.2 | IC4.20 31.11,63.98 C19.2 | IC8.16 v42.54,88.11 | C11.2 74.92,67.79 v80.64,67.79
  Bottom 0.406: 83.18,22.07 R10.2
  Bottom 0.61: 75.56,43.66 76.83,44.93 76.83,61.44 75.56,61.44 | v141.6,57 143.5,58.9 149.85,58.9 153.03,62.08 153.03,65.89 154.3,67.16 U$1.7 U$1.8 | 79.37,22.71 v79.37,33.5
  Bottom 1.016: C2.2 19.68,27.15 24.76,22.07 IC14.3 24.76,15.72 | P1.C3 13.33,15.72 14.6,14.45 17.77,14.45 19.04,15.72 24.76,15.72 | 80.64,22.71 79.37,22.71 60.96,22.71 57.15,18.9 34.29,18.9 31.11,15.72 24.76,15.72
  Bottom 1.27: J2.4 139.06,22.71 132.71,16.36 95.24,16.36 89.53,22.07 83.18,22.07 81.91,22.07 81.27,22.71 80.64,22.71
VDD
  Top 0.254: C4.+ 14.6,6.83
  Top 1.016: 14.6,6.83 16.5,8.74 16.5,13.18 19.04,15.72 19.04,19.53 24.12,24.61 25.39,24.61 27.3,22.71 IC14.2
  Bottom 0.406: 7.62,29.06 8.89,27.15 12.06,27.15 14.6,29.69 6.98,29.69
  Bottom 0.61: 28.57,29.69 31.11,29.69 31.74,30.33 38.1,30.33 D2.A | 6.98,29.69 7.62,29.06
  Bottom 1.016: 27.3,27.15 R1.2 28.57,29.69 14.6,29.69 | 27.3,27.15 C3.2 | 6.98,29.69 P1.A9 | IC14.2 27.3,27.15

### Text on the board
Top: CSA_PWR-V1.2B | (C) A. Fachat